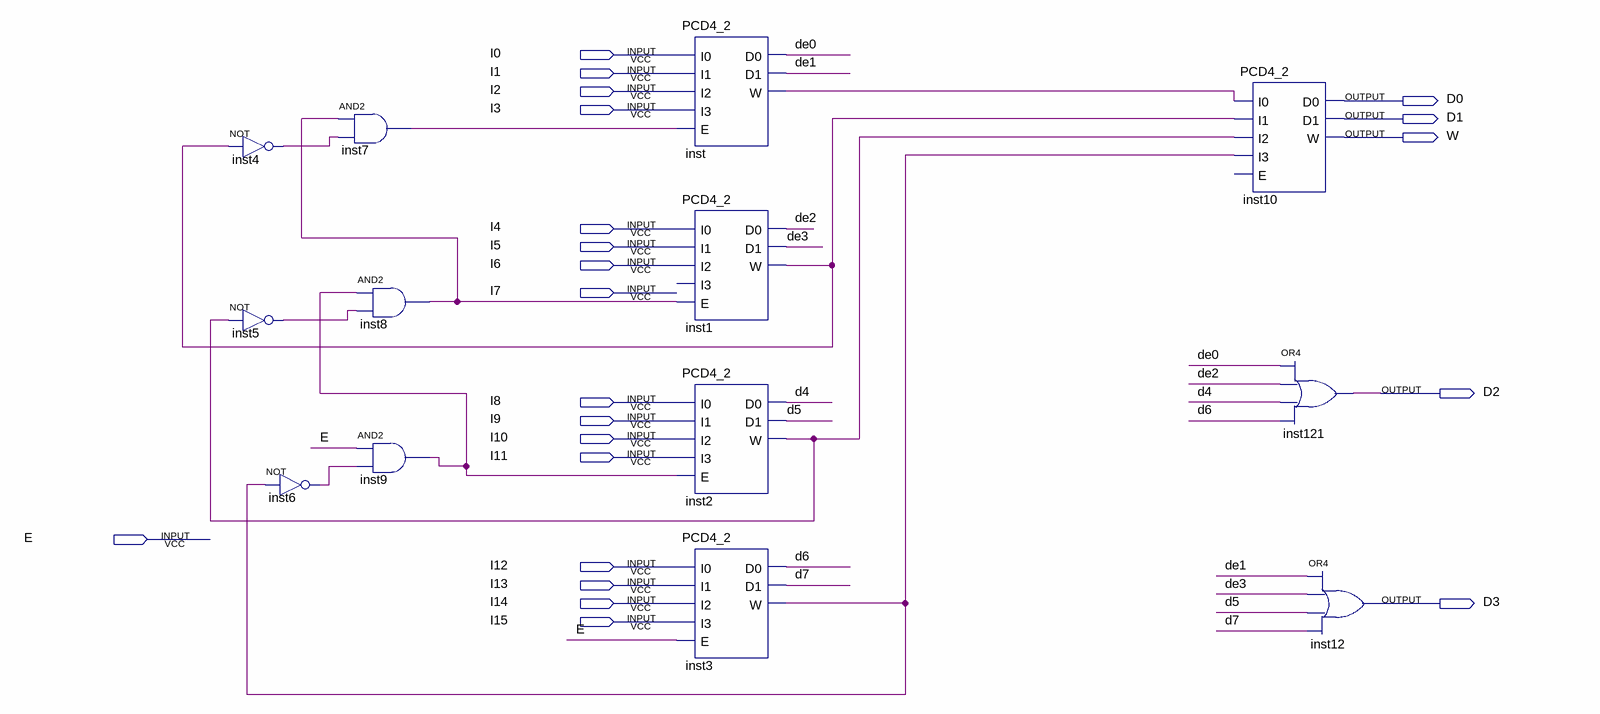
[diagram p0: schematic sheet]
// Quartus schematic PCD16_4.bdf as structural Verilog: 13 symbols, 22 pins
module PCD16_4 (
  input  I0,
  input  I1,
  input  I2,
  input  I3,
  input  I4,
  input  I5,
  input  I6,
  input  I7,
  input  I8,
  input  I9,
  input  I10,
  input  I11,
  input  E,
  input  I12,
  input  I13,
  input  I14,
  input  I15,
  output D0,
  output D1,
  output W,
  output D2,
  output D3
);

  wire d4, d5, d6, d7, de0, de1, de2, de3, inst1_w, inst2_w, inst3_w, inst4_out, inst5_out, inst6_out,
       inst7_out, inst8_out, inst9_out, inst_w;

  not inst4 (inst4_out, inst1_w);
  not inst5 (inst5_out, inst2_w);
  not inst6 (inst6_out, inst3_w);
  and inst7 (inst7_out, inst8_out, inst4_out);
  and inst8 (inst8_out, inst9_out, inst5_out);
  and inst9 (inst9_out, E, inst6_out);
  PCD4_2 inst (.I0(I0), .I1(I1), .I2(I2), .I3(I3), .E(inst7_out), .D0(de0), .D1(de1), .W(inst_w));
  PCD4_2 inst1 (.I0(I4), .I1(I5), .I2(I6), .E(inst8_out), .D0(de2), .D1(de3), .W(inst1_w));  // open: I3
  PCD4_2 inst2 (.I0(I8), .I1(I9), .I2(I10), .I3(I11), .E(inst9_out), .D0(d4), .D1(d5), .W(inst2_w));
  PCD4_2 inst3 (.I0(I12), .I1(I13), .I2(I14), .I3(I15), .E(E), .D0(d6), .D1(d7), .W(inst3_w));
  PCD4_2 inst10 (.I0(inst_w), .I1(inst1_w), .I2(inst2_w), .I3(inst3_w), .D0(D0), .D1(D1), .W(W));  // open: E
  or inst121 (D2, de0, de2, d4, d6);
  or inst12 (D3, de1, de3, d5, d7);
endmodule
